# EAGLE design mazda (EAGLE 9.6.2)
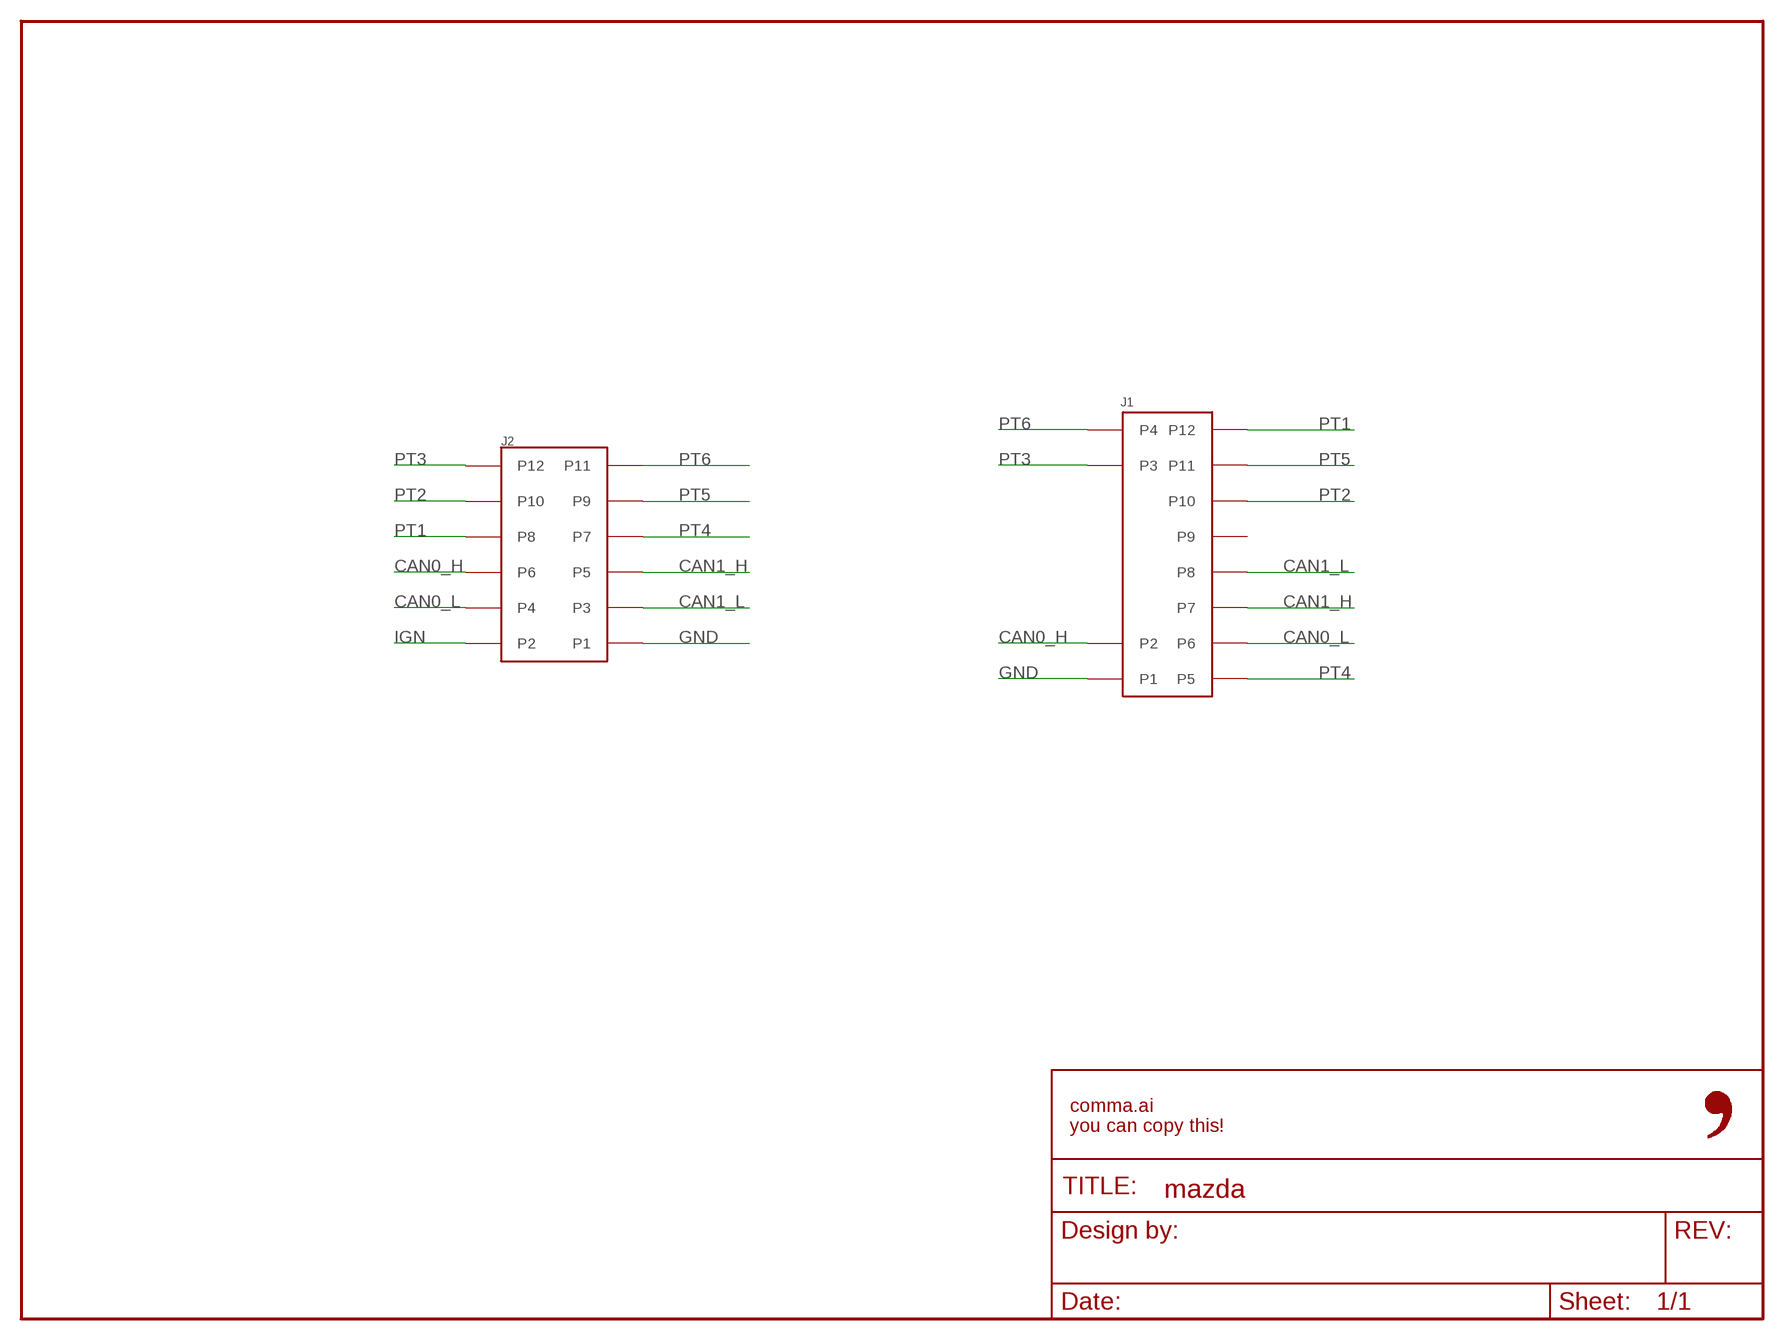
[diagram p0: schematic, sheet 1]

## Parts
FRAME1  FRAME-LETTER-OPENNO_PACKAGE  [DUMMY]
J1  0348260124  [0348260124]
J2  5018761240  [5018761240]

## Nets
CAN0_H: J1.P2 J2.P6
CAN0_L: J1.P6 J2.P4
CAN1_H: J1.P7 J2.P5
CAN1_L: J1.P8 J2.P3
GND: J1.P1 J2.P1
IGN: J2.P2
PT1: J1.P12 J2.P8
PT2: J1.P10 J2.P10
PT3: J1.P3 J2.P12
PT4: J1.P5 J2.P7
PT5: J1.P11 J2.P9
PT6: J1.P4 J2.P11
Unconnected: J1.P9

## Library data of the parts
FRAME1 = comma.ai:FRAME-LETTER-OPEN: Schematic Frame - Letter Standard 8.5x11 US Letter frame; DESIGNER: Nobody; VERSION: v01
J1 = 0348240124:0348260124; CPN: CAI-HARNESS-MOLEX-0348260124
J2 = comma.ai:5018761240; CPN: CAI-HARNESS-MOLEX-5018761240

## Board
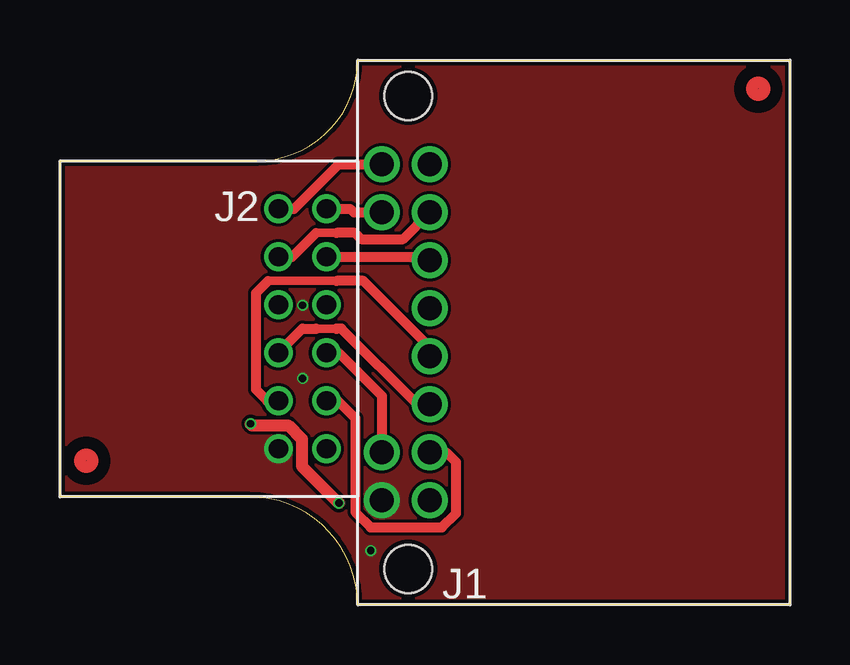
[diagram p1: board, top side]
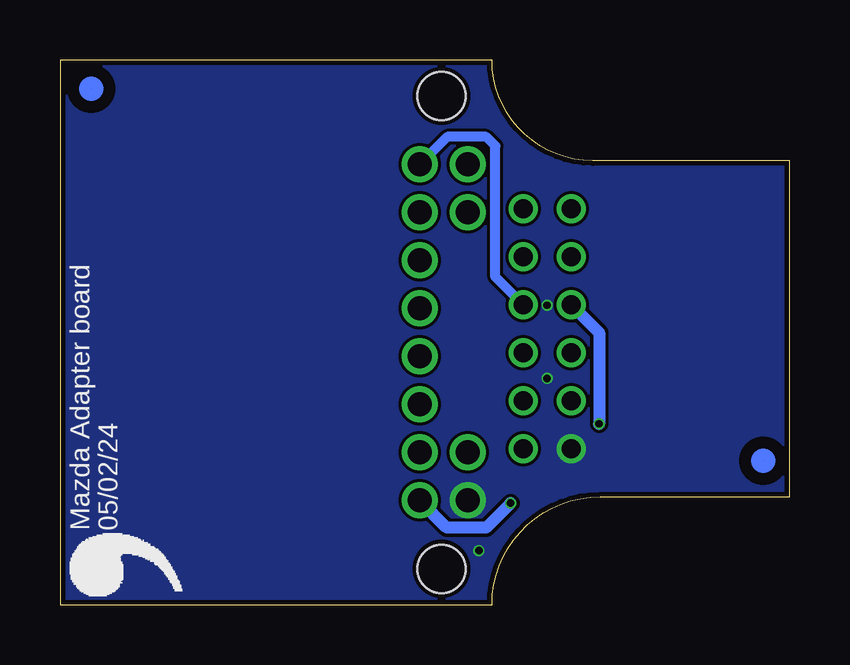
[diagram p2: board, bottom side, seen from below]

Size 30.4 x 22.7 mm. Coordinates in mm from the lower left corner, seen from the top.
Outline: 0,18.5 8.2,18.5 arc90 12.4,22.7 30.4,22.7 30.4,0 12.4,0 arc90 7.9,4.5 0,4.5 0,18.5
Copper layers (1*16): Top 0.035mm / dielectric 1.5mm / Bottom 0.035mm
Design rules "jlcpcb_2layer": minimum track width 5mil, minimum drill 12mil, track to track 5mil, track to pad 5mil, pad to pad 5mil, via to via 5mil, smd to smd 5mil, copper to edge 8mil, drill to drill 8mil, minimum pad ring 3mil, minimum via ring 3mil, stop-mask expansion 4mm, vias tented up to drill 20mil, thermal gap 10mil

### Footprints (pad centres in the part's own frame; a part is rotated, then mirrored left to right if it is on the bottom)
0348260124 = drill 1: P1 -7,2; P2 -5,2; P3 5,2; P4 7,2; P5 -7,0; P6 -5,0; P7 -3,0; P8 -1,0; P9 1,0; P10 3,0; P11 5,0; P12 7,0 | hole 2: -9.85,0.9; 9.85,0.9
5018761240 = drill 0.8: P1 5,-1; P2 5,1; P3 3,-1; P4 3,1; P5 1,-1; P6 1,1; P7 -1,-1; P8 -1,1; P9 -3,-1; P10 -3,1; P11 -5,-1; P12 -5,1

### Placement (x,y rotation side)
FRAME1  -0.92,-2.06 0 top
J1  15.41,11.35 90 top
J2  10.1,11.5 270 top
U$1  [LOGO]  25.01,-0.31 90 bottom
U$2  [FIDUCIAL]  29.1,21.5 0 top
U$3  [FIDUCIAL]  1.1,6 0 top

### Tracks (layer width: path | path; a pad name or v marks a point on that pad's centre or on a via)
CAN0_H
  Top 0.406: J2.P6 11.61,10.5 13.41,8.7 J1.P2
CAN0_L
  Top 0.406: J2.P4 11.58,8.5 12.31,7.77 12.31,3.86 12.95,3.22 15.92,3.22 16.5,3.81 16.5,5.94 16.09,6.35 J1.P6
CAN1_H
  Top 0.356: 11.53,11.5 10.67,11.5
  Top 0.406: J2.P5 10.1,11.5 10.67,11.5 | 11.53,11.5 11.73,11.5 14.88,8.35 J1.P7
CAN1_L
  Top 0.356: 11.53,13.5 8.67,13.5
  Top 0.406: 8.67,13.5 8.17,13 8.17,8.96 8.63,8.5 J2.P3 | 11.53,13.5 12.64,13.5 15.41,10.73 J1.P8
GND  (via drill 0.3)
  other vias: 12.94,2.26 10.1,9.43 10.1,12.48
  pour Top (no thermals): -1.31,24.02 31.69,24.02 31.69,-0.98 -1.31,-0.98
  pour Bottom (no thermals): -2.31,25.02 32.69,25.02 32.69,-1.98 -2.31,-1.98
PT1
  Bottom 0.406: J2.P8 12.26,13.66 12.26,19.12 12.64,19.5 14.26,19.5 J1.P12
PT2
  Top 0.406: J2.P10 15.26,14.5 J1.P10
PT3
  Top 0.406: J2.P12 12.09,16.5 12.24,16.35 J1.P3
PT4  (via drill 0.3)
  Top 0.508: v7.94,7.54 8,7.48 9.51,7.48 10.08,6.91 10.08,5.78 v11.62,4.24
  Bottom 0.508: J2.P7 7.94,11.34 v7.94,7.54 | v11.62,4.24 12.64,3.22 14.28,3.22 J1.P5
PT5
  Top 0.356: 11.53,15.5 10.67,15.5
  Top 0.406: 10.67,15.5 9.67,14.5 J2.P9 | 11.53,15.5 12.28,15.5 12.54,15.24 14.3,15.24 J1.P11
PT6
  Top 0.406: J2.P11 9.76,16.5 11.61,18.35 J1.P4

### Text on the board
bNames: 05/02/24 | Mazda Adapter board